# Altium schematic sheet FFT_Device.SchDoc
size B
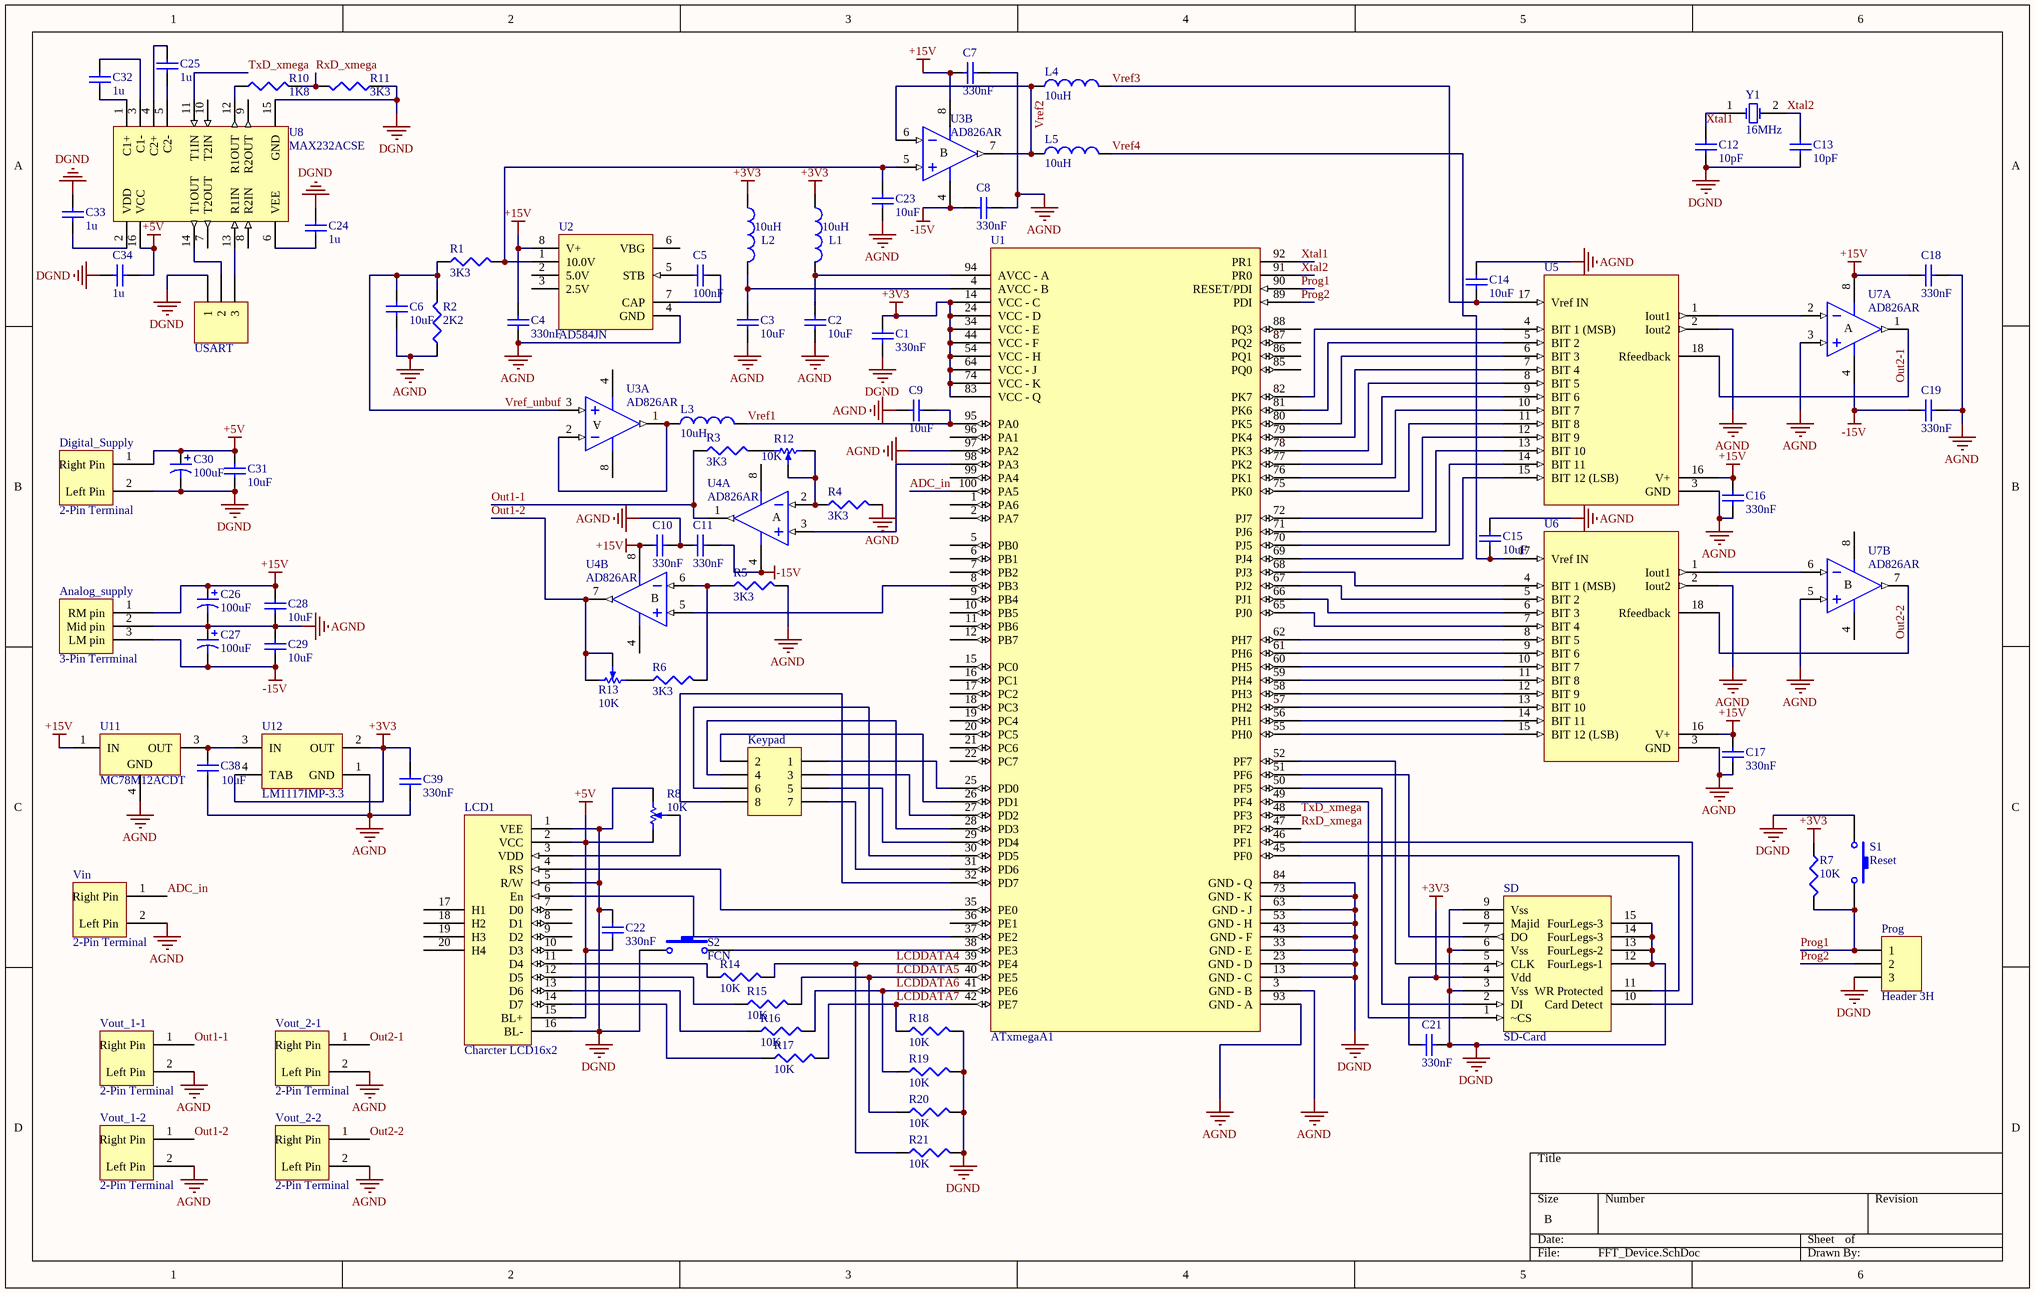
[diagram p0: FFT_Device.SchDoc]

## Parts
Analog_supply  3-Pin Terrminal  [3-pin Terminal]
C1  value 330nF  [MELF-R3216-1206]  (hidden comment: Cap Semi)
C2  value 10uF  [MELF-R3216-1206]  (hidden comment: Cap Semi)
C3  value 10uF  [MELF-R3216-1206]  (hidden comment: Cap Semi)
C4  value 330nF  [MELF-R3216-1206]  (hidden comment: Cap Semi)
C5  value 100nF  [MELF-R3216-1206]  (hidden comment: Cap Semi)
C6  value 10uF  [MELF-R3216-1206]  (hidden comment: Cap Semi)
C7  value 330nF  [MELF-R3216-1206]  (hidden comment: Cap Semi)
C8  value 330nF  [MELF-R3216-1206]  (hidden comment: Cap Semi)
C9  value 10uF  [MELF-R3216-1206]  (hidden comment: Cap Semi)
C10  value 330nF  [MELF-R3216-1206]  (hidden comment: Cap Semi)
C11  value 330nF  [MELF-R3216-1206]  (hidden comment: Cap Semi)
C12  value 10pF  [MELF-R3216-1206]  (hidden comment: Cap Semi)
C13  value 10pF  [MELF-R3216-1206]  (hidden comment: Cap Semi)
C14  value 10uF  [MELF-R3216-1206]  (hidden comment: Cap Semi)
C15  value 10uF  [MELF-R3216-1206]  (hidden comment: Cap Semi)
C16  value 330nF  [MELF-R3216-1206]  (hidden comment: Cap Semi)
C17  value 330nF  [MELF-R3216-1206]  (hidden comment: Cap Semi)
C18  value 330nF  [MELF-R3216-1206]  (hidden comment: Cap Semi)
C19  value 330nF  [MELF-R3216-1206]  (hidden comment: Cap Semi)
C21  value 330nF  [MELF-R3216-1206]  (hidden comment: Cap Semi)
C22  value 330nF  [MELF-R3216-1206]  (hidden comment: Cap Semi)
C23  value 10uF  [MELF-R3216-1206]  (hidden comment: Cap Semi)
C24  value 1u  [MELF-R3216-1206]  (hidden comment: Cap Semi)
C25  value 1u  [MELF-R3216-1206]  (hidden comment: Cap Semi)
C26  100uF  [Cap Pole-100u]
C27  100uF  [Cap Pole-100u]
C28  value 10uF  [CAPTANT100u]  (hidden comment: Cap Semi)
C29  value 10uF  [CAPTANT100u]  (hidden comment: Cap Semi)
C30  100uF  [Cap Pole-100u]
C31  value 10uF  [CAPTANT100u]  (hidden comment: Cap Semi)
C32  value 1u  [MELF-R3216-1206]  (hidden comment: Cap Semi)
C33  value 1u  [MELF-R3216-1206]  (hidden comment: Cap Semi)
C34  value 1u  [MELF-R3216-1206]  (hidden comment: Cap Semi)
C38  value 10uF  [MELF-R3216-1206]  (hidden comment: Cap Semi)
C39  value 330nF  [MELF-R3216-1206]  (hidden comment: Cap Semi)
Digital_Supply  2-Pin Terminal  [2-pin Terminal]
Keypad  Header 4X2  [HDR2X4]  (value not drawn)
L1  value 10uH  [MELF-R3216-1206]  (hidden comment: Inductor)
L2  value 10uH  [MELF-R3216-1206]  (hidden comment: Inductor)
L3  value 10uH  [MELF-R3216-1206]  (hidden comment: Inductor)
L4  value 10uH  [MELF-R3216-1206]  (hidden comment: Inductor)
L5  value 10uH  [MELF-R3216-1206]  (hidden comment: Inductor)
LCD1  Charcter LCD16x2  [LCD16x2]
Prog  Header 3H  [HDR1X3H]
R1  value 3K3  [MELF-R3216-1206]  (hidden comment: Res3)
R2  value 2K2  [MELF-R3216-1206]  (hidden comment: Res3)
R3  value 3K3  [MELF-R3216-1206]  (hidden comment: Res3)
R4  value 3K3  [MELF-R3216-1206]  (hidden comment: Res3)
R5  value 3K3  [MELF-R3216-1206]  (hidden comment: Res3)
R6  value 3K3  [MELF-R3216-1206]  (hidden comment: Res3)
R7  value 10K  [MELF-R3216-1206]  (hidden comment: Res3)
R8  10K  [POT4MM-2]
R10  value 1K8  [MELF-R3216-1206]  (hidden comment: Res3)
R11  value 3K3  [MELF-R3216-1206]  (hidden comment: Res3)
R12  10K  [POT4MM-2]
R13  10K  [POT4MM-2]
R14  value 10K  [MELF-R3216-1206]  (hidden comment: Res3)
R15  value 10K  [MELF-R3216-1206]  (hidden comment: Res3)
R16  value 10K  [MELF-R3216-1206]  (hidden comment: Res3)
R17  value 10K  [MELF-R3216-1206]  (hidden comment: Res3)
R18  value 10K  [MELF-R3216-1206]  (hidden comment: Res3)
R19  value 10K  [MELF-R3216-1206]  (hidden comment: Res3)
R20  value 10K  [MELF-R3216-1206]  (hidden comment: Res3)
R21  value 10K  [MELF-R3216-1206]  (hidden comment: Res3)
S1  Reset  [SMD_Switch]
S2  FCN  [SMD_Switch]
SD  SD-Card  [SD-Card-Socket]
U1  ATxmegaA1  [TQFP100]
U2  AD584JN  [N-8]
U3  AD826AR  [R-8D_N]  (parts A,B of 2)
U4  AD826AR  [R-8D_N]  (parts A,B of 2)
U5  DAC  [DIP-18/D23]  (value not drawn)
U6  DAC  [DIP-18/D23]  (value not drawn)
U7  AD826AR  [R-8D_N]  (parts A,B of 2)
U8  MAX232ACSE  [NSO16_N]
U11  MC78M12ACDT  [369A-13]
U12  LM1117IMP-3.3  [MP04A_L]
USART  Header 3  [HDR1X3]  (value not drawn)
Vin  2-Pin Terminal  [2-pin Terminal]
Vout_1-1  2-Pin Terminal  [2-pin Terminal]
Vout_1-2  2-Pin Terminal  [2-pin Terminal]
Vout_2-1  2-Pin Terminal  [2-pin Terminal]
Vout_2-2  2-Pin Terminal  [2-pin Terminal]
Y1  16MHz  [HC-49U]

## Nets
+3V3: C1.1 C21.2 C39.2 L1.2 L2.2 R7.1 SD.4(Vdd) U1.14(VCC_-_C) U1.24(VCC_-_D) U1.34(VCC_-_E) U1.44(VCC_-_F) U1.54(VCC_-_H) U1.64(VCC_-_J) U1.74(VCC_-_K) U1.83(VCC_-_Q) U12.2(OUT) U12.4(TAB)
+5V: C22.1 C30.1 C31.2 C34.1 Digital_Supply.1(Right_Pin) LCD1.2(VCC) LCD1.15(BL+) R8.CCW(-) U8.16(VCC)
+15V: Analog_supply.1(RM_pin) C4.2 C7.2 C10.2 C16.2 C17.2 C18.1 C26.1 C28.2 U2.8(V+) U3.8(V+) U4.8(V+) U5.16(V+) U6.16(V+) U7.8(V+) U11.1(IN)
-15V: Analog_supply.3(LM_pin) C8.1 C11.1 C19.1 C27.2 C29.1 U3.4(V-) U4.4(V-) U7.4(V-)
AGND: Analog_supply.2(Mid_pin) C2.1 C3.1 C4.1 C6.1 C7.1 C8.2 C9.2 C10.1 C11.2 C14.1 C15.1 C16.1 C17.1 C18.2 C19.2 C23.1 C26.2 C27.1 C28.1 C29.2 C38.1 C39.1 R2.2 R4.1 R5.1 U1.3(GND_-_B) U1.93(GND_-_A) U1.97(PA2) U2.4(GND) U5.2(Iout2) U5.3(GND) U6.2(Iout2) U6.3(GND) U7.3(IN+) U7.5(IN+) U11.4(GND) U12.1(GND) Vin.2(Left_Pin) Vout_1-1.2(Left_Pin) Vout_1-2.2(Left_Pin) Vout_2-1.2(Left_Pin) Vout_2-2.2(Left_Pin)
DGND: C1.2 C12.2 C13.1 C21.1 C22.2 C24.2 C30.2 C31.1 C33.1 C34.2 Digital_Supply.2(Left_Pin) LCD1.1(VEE) LCD1.5(R/W) LCD1.16(BL-) Prog.3 R8.CW(+) R11.1 R18.1 R19.1 R20.1 R21.1 S1.2 S2.2 SD.3(Vss) SD.6(Vss) SD.9(Vss) SD.12(FourLegs-1) SD.13(FourLegs-2) SD.14(FourLegs-3) SD.15(FourLegs-3) U1.13(GND_-_C) U1.23(GND_-_D) U1.33(GND_-_E) U1.43(GND_-_F) U1.53(GND_-_H) U1.63(GND_-_J) U1.73(GND_-_K) U1.84(GND_-_Q) U8.15(GND) USART.1
ADC_in: U1.100(PA5) Vin.1(Right_Pin)
LCDDATA4: R14.1 R21.2 U1.39(PE4)
LCDDATA5: R15.1 R20.2 U1.40(PE5)
LCDDATA6: R16.1 R19.2 U1.41(PE6)
LCDDATA7: R17.1 R18.2 U1.42(PE7)
Out1-1: R3.2 U4.1(OUT) Vout_1-1.1(Right_Pin)
Out1-2: R13.CW(+) R13.W U4.7(OUT) Vout_1-2.1(Right_Pin)
Out2-1: U5.18(Rfeedback) U7.1(OUT) Vout_2-1.1(Right_Pin)
Out2-2: U6.18(Rfeedback) U7.7(OUT) Vout_2-2.1(Right_Pin)
Prog1: Prog.1 R7.2 S1.1 U1.90(RESET/PDI)
Prog2: Prog.2 U1.89(PDI)
RxD_xmega: R10.2 R11.2 U1.47(PF2)
TxD_xmega: U1.48(PF3) U8.11(T1IN)
Vref1: C9.1 L3.1 U1.95(PA0)
Vref2: L4.2 L5.2 U3.6(IN-) U3.7(OUT)
Vref3: C14.2 L4.1 U5.17(Vref_IN)
Vref4: C15.2 L5.1 U6.17(Vref_IN)
Vref_unbuf: C6.2 R1.2 R2.1 U3.3(IN+)
Xtal1: C12.1 U1.92(PR1) Y1.1(OSC1)
Xtal2: C13.2 U1.91(PR0) Y1.2(OSC2)
NetC2_2: C2.2 L1.1 U1.94(AVCC_-_A)
NetC3_2: C3.2 L2.1 U1.4(AVCC_-_B)
NetC5_1: C5.1 U2.5(STB)
NetC5_2: C5.2 U2.7(CAP)
NetC23_2: C23.2 R1.1 U2.1(10.0V) U3.5(IN+)
NetC24_1: C24.1 U8.6(VEE)
NetC25_1: C25.1 U8.5(C2-)
NetC25_2: C25.2 U8.4(C2+)
NetC32_1: C32.1 U8.3(C1-)
NetC32_2: C32.2 U8.1(C1+)
NetC33_2: C33.2 U8.2(VDD)
NetC38_2: C38.2 U11.3(OUT) U12.3(IN)
NetKeypad_1: Keypad.1 U1.25(PD0)
NetKeypad_2: Keypad.2 U1.26(PD1)
NetKeypad_3: Keypad.3 U1.27(PD2)
NetKeypad_4: Keypad.4 U1.28(PD3)
NetKeypad_5: Keypad.5 U1.29(PD4)
NetKeypad_6: Keypad.6 U1.30(PD5)
NetKeypad_7: Keypad.7 U1.31(PD6)
NetKeypad_8: Keypad.8 U1.32(PD7)
NetL3_2: L3.2 U3.1(OUT) U3.2(IN-)
NetLCD1_3: LCD1.3(VDD) R8.W
NetLCD1_4: LCD1.4(RS) U1.35(PE0)
NetLCD1_6: LCD1.6(En) U1.37(PE2)
NetLCD1_11: LCD1.11(D4) R14.2
NetLCD1_12: LCD1.12(D5) R15.2
NetLCD1_13: LCD1.13(D6) R16.2
NetLCD1_14: LCD1.14(D7) R17.2
NetR3_1: R3.1 R12.CCW(-)
NetR4_2: R4.2 R12.CW(+) R12.W U4.2(IN-)
NetR5_2: R5.2 R6.1 U4.6(IN-)
NetR6_2: R6.2 R13.CCW(-)
NetR10_1: R10.1 U8.12(R1OUT)
NetS2_1: S2.1 U1.38(PE3)
NetSD_1: SD.1(~CS) U1.49(PF4)
NetSD_2: SD.2(DI) U1.50(PF5)
NetSD_5: SD.5(CLK) U1.52(PF7)
NetSD_7: SD.7(DO) U1.51(PF6)
NetSD_10: SD.10(Card_Detect) U1.46(PF1)
NetSD_11: SD.11(WR_Protected) U1.45(PF0)
NetU1_8: U1.8(PB3) U4.5(IN+)
NetU1_55: U1.55(PH0) U6.15(BIT_12_(LSB))
NetU1_56: U1.56(PH1) U6.14(BIT_11)
NetU1_57: U1.57(PH2) U6.13(BIT_10)
NetU1_58: U1.58(PH3) U6.12(BIT_9)
NetU1_59: U1.59(PH4) U6.11(BIT_8)
NetU1_60: U1.60(PH5) U6.10(BIT_7)
NetU1_61: U1.61(PH6) U6.9(BIT_6)
NetU1_62: U1.62(PH7) U6.8(BIT_5)
NetU1_65: U1.65(PJ0) U6.7(BIT_4)
NetU1_66: U1.66(PJ1) U6.6(BIT_3)
NetU1_67: U1.67(PJ2) U6.5(BIT_2)
NetU1_68: U1.68(PJ3) U6.4(BIT_1_(MSB))
NetU1_69: U1.69(PJ4) U5.15(BIT_12_(LSB))
NetU1_70: U1.70(PJ5) U5.14(BIT_11)
NetU1_71: U1.71(PJ6) U5.13(BIT_10)
NetU1_72: U1.72(PJ7) U5.12(BIT_9)
NetU1_75: U1.75(PK0) U5.11(BIT_8)
NetU1_76: U1.76(PK1) U5.10(BIT_7)
NetU1_77: U1.77(PK2) U5.9(BIT_6)
NetU1_78: U1.78(PK3) U5.8(BIT_5)
NetU1_79: U1.79(PK4) U5.7(BIT_4)
NetU1_80: U1.80(PK5) U5.6(BIT_3)
NetU1_81: U1.81(PK6) U5.5(BIT_2)
NetU1_82: U1.82(PK7) U5.4(BIT_1_(MSB))
NetU1_98: U1.98(PA3) U4.3(IN+)
NetU5_1: U5.1(Iout1) U7.2(IN-)
NetU6_1: U6.1(Iout1) U7.6(IN-)
NetU8_13: U8.13(R1IN) USART.3
NetU8_14: U8.14(T1OUT) USART.2

Not connected (* = marked no-connect by the designer): LCD1 7(D0) 8(D1) 9(D2) 10(D3) 17(H1) 18(H2) 19(H3) 20(H4); SD 8(Majid); U1 1(PA6) 2(PA7) 5(PB0) 6(PB1) 7(PB2) 9(PB4) 10(PB5) 11(PB6) 12(PB7) 15(PC0) 16(PC1) 17(PC2) 18(PC3) 19(PC4) 20(PC5) 21(PC6) 22(PC7) 36(PE1) 85(PQ0) 86(PQ1) 87(PQ2) 88(PQ3) 96(PA1) 99(PA4); U2 2(5.0V) 3(2.5V) 6(VBG); U8 7(T2OUT) 8(R2IN) 9(R2OUT) 10(T2IN)

## Notes on the sheet
- (in symbol AD826AR, part A) A
- (in symbol AD826AR, part B) B

## Library data of the parts
C1-C19 C21-C25 C28 C29 C31-C34 C38 C39 = Cap Semi: Capacitor (Semiconductor SIM Model); Published: 8-Jun-2000; PackageReference: C1206; Publisher: Altium Limited
  C1-C19 C21-C25 C32-C34 C38 C39: LatestRevisionDate: 17-Jul-2002; LatestRevisionNote: Re-released for DXP Platform.
  C28 C29 C31: LatestRevisionDate: 29-May-2009; LatestRevisionNote: IPC-7351 Footprint Added.; PackageDescription: Chip Capacitor
C26 C27 C30 = Cap Pole
Keypad = Header 4X2: Header, 4-Pin, Dual row; LatestRevisionDate: 17-Jul-2002; LatestRevisionNote: Re-released for DXP Platform.; Publisher: Altium Limited
L1-L5 = Inductor: Code_IEC: 1005; Published: 8-Jun-2000; LatestRevisionDate: 17-Jul-2002; LatestRevisionNote: Re-released for DXP Platform.; PackageReference: 0402-A; Publisher: Altium Limited; Code_JEITA: 0402
LCD1 = LCD16x2
Prog = Header 3H: Header, 3-Pin, Right Angle; LatestRevisionDate: 17-Jul-2002; LatestRevisionNote: Re-released for DXP Platform.; Publisher: Altium Limited
R1-R7 R10 R11 R14-R21 = Res3: Resistor; Published: 8-Jun-2000; LatestRevisionDate: 04-Mar-2005; LatestRevisionNote: PCB Footprint replaced.; PackageReference: J1-0603; Publisher: Altium Limited
R8 R12 R13 = RPot SM: Square Trimming Potentiometer; Published: 17-Dec-2003; DatasheetDocument: Oct-2003; PackageReference: POT4MM-2; Publisher: Altium Limited; ComponentLink1Description: Manufacturer Link; ComponentLink1URL: http://bourns.com/2/search.html
S1 S2 = SW-PB: Switch; Published: 24-Mar-1999; LatestRevisionDate: 17-Jul-2002; LatestRevisionNote: Re-released for DXP Platform.; PackageReference: SPST-2; Publisher: Altium Limited
U1 = ATxMega_A1: High Performance 8/16bit MCU
U2 = AD584JN: 10V, 7.5V, 5V, 2.5V Pin Programmable Precision Voltage Reference; Published: 8-Jun-2000; LatestRevisionDate: 29-May-2009; LatestRevisionNote: Component Body Added.; DatasheetVersion: REV. A; PackageVersion: revA; PackageReference: N-8; Publisher: Altium Limited; PackageDescription: DIP, 8-Pin, Row Spacing 7.62 mm, Pitch 2.54 mm; ComponentLink1Description: Manufacturer Link; ComponentLink1URL: http://www.analog.com/en/prod/0,,769_838_AD584%2C00.html; ComponentLink2Description: Datasheet; ComponentLink2URL: http://www.analog.com/UploadedFiles/Data_Sheets/115302565AD584_b.pdf
U3 U4 U7 = AD826AR: High-Speed, Low-Power Dual Operational Amplifier; Published: 8-Jun-2000; LatestRevisionDate: 13-Apr-2006; LatestRevisionNote: IPC-7351 Footprint Added.; DatasheetVersion: REV. A 1995; PackageVersion: 1998; PackageReference: R-8D; Publisher: Altium Limited; PackageDescription: 8-Pin Narrow Body Small Outline Integrated Circuit 1.27 mm Pitch; ComponentLink1Description: Manufacturer Link; ComponentLink1URL: http://www.analog.com/en/prod/0,,759_786_AD826%2C00.html; ComponentLink2Description: Datasheet; ComponentLink2URL: http://www.analog.com/UploadedFiles/Data_Sheets/432952987AD826_b.pdf
U5 U6 = AD7541
U8 = MAX232ACSE: +5V Powered, Multi-Channel RS-232 Driver/Receiver; Published: 16-Jan-2001; LatestRevisionDate: 13-Apr-2006; LatestRevisionNote: IPC-7351 Footprint Added.; PackageReference: NSO16; Publisher: Altium Limited; PackageDescription: 16-Pin Small Outline Integrated Circuit 1.27 mm Pitch; Code_JEDEC: MS-012-AC; Code_IPC: SOIC127P600-16; ComponentLink1Description: Manufacturer Link; ComponentLink1URL: http://www.maxim-ic.com/; ComponentLink2Description: Datasheet; ComponentLink2URL: http://pdfserv.maxim-ic.com/en/ds/MAX220-MAX249.pdf
U11 = MC78M12ACDT: Three-Terminal Medium Current Positive Voltage Regulator; Note: Pin 2 is electrically connected to Pin 4; Pin 2 is trimmed and not drawn;; Published: 15-Apr-2002; DatasheetVersion: Apr-2000; PackageVersion: 1997; PackageReference: 369A-13; Publisher: Altium Limited; PackageDescription: D-PAK/TO-252-AA; 3 Leads (1 Cropped); Body 10.3 (inc. leads) x 6.7 mm (LxW max); ComponentLink1Description: Manufacturer Link; ComponentLink1URL: http://www.onsemi.com/site/products/taxonomy/0,4438,503,00.html; ComponentLink2Description: Datasheet; ComponentLink2URL: http://www.onsemi.com/pub/Collateral/MC78M00-D.PDF
U12 = LM1117IMP-3.3: 800mA Low-Dropout Linear Regulator; Manufacturer: National Semiconductor; CompType: LDO IC; PackageTopMarking: XYTT*N05B; Published: 27-Nov-2008; DatasheetVersion: Apr-2006; PackageVersion: revB, Apr-2003; PackageReference: MP04A; Publisher: Altium Limited; PackageDescription: Molded SOT-223, 6.50 x 3.56 x 1.6mm Body, 4 Lead, 2.3mm Pitch; PartNumber: LM1117IMP-3.3; RoHS: O; PinCount: 4; DigiKeyPartNumber: LM1117IMP-3.3CT-ND; Code_JEDEC: TO-261-AA; Code_IPC: SOT223-4; ComponentLink1Description: LM1117 Datasheet; ComponentLink1URL: http://www.national.com/ds/LM/LM1117.pdf; ComponentLink2Description: LM1117 Web Page; ComponentLink2URL: http://www.national.com/pf/LM/LM1117.html; ComponentLink3Description: MP04A Package Page; ComponentLink3URL: http://www.national.com/packaging/folders/mp04a.html
USART = Header 3: Header, 3-Pin; LatestRevisionDate: 17-Jul-2002; LatestRevisionNote: Re-released for DXP Platform.; Publisher: Altium Limited
Y1 = ECS-10-13-1: Crystal Oscillator; Published: 17-Jul-2002; DatasheetDocument: 18-Apr-2000; PackageReference: HC-49U; Publisher: Altium Limited; ComponentLink1Description: Manufacturer Link; ComponentLink1URL: http://www.ecsxtal.com/; ComponentLink2Description: Datasheet; ComponentLink2URL: http://www.ecsxtal.com/pdf2/HC49U.PDF